# EAGLE design I2C Interface (EAGLE 9.4.2)
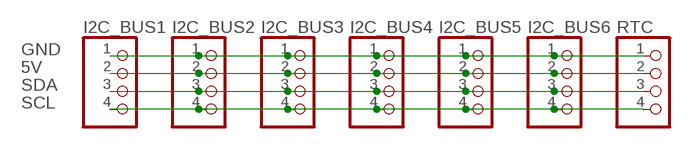
[diagram p0: schematic, sheet 1]

## Parts
I2C_BUS1  PINHD-1X4  [1X04]
I2C_BUS2  PINHD-1X4  [1X04]
I2C_BUS3  PINHD-1X4  [1X04]
I2C_BUS4  PINHD-1X4  [1X04]
I2C_BUS5  PINHD-1X4  [1X04]
I2C_BUS6  PINHD-1X4  [1X04]
RTC  PINHD-1X4  [1X04]

## Nets
5V: I2C_BUS1.2 I2C_BUS2.2 I2C_BUS3.2 I2C_BUS4.2 I2C_BUS5.2 I2C_BUS6.2 RTC.2
GND: I2C_BUS1.1 I2C_BUS2.1 I2C_BUS3.1 I2C_BUS4.1 I2C_BUS5.1 I2C_BUS6.1 RTC.1
SCL: I2C_BUS1.4 I2C_BUS2.4 I2C_BUS3.4 I2C_BUS4.4 I2C_BUS5.4 I2C_BUS6.4 RTC.4
SDA: I2C_BUS1.3 I2C_BUS2.3 I2C_BUS3.3 I2C_BUS4.3 I2C_BUS5.3 I2C_BUS6.3 RTC.3

## Library data of the parts
I2C_BUS1-I2C_BUS6 RTC = pinhead:PINHD-1X4: PIN HEADER

## Board
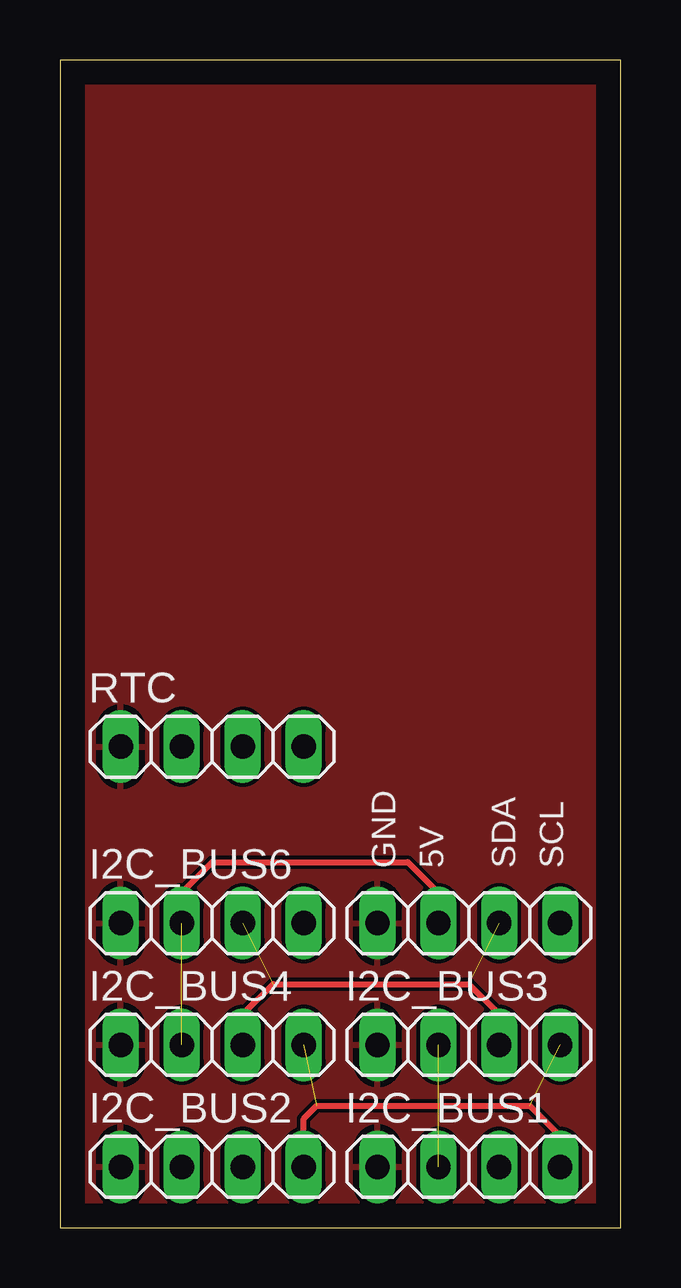
[diagram p1: board, top side]
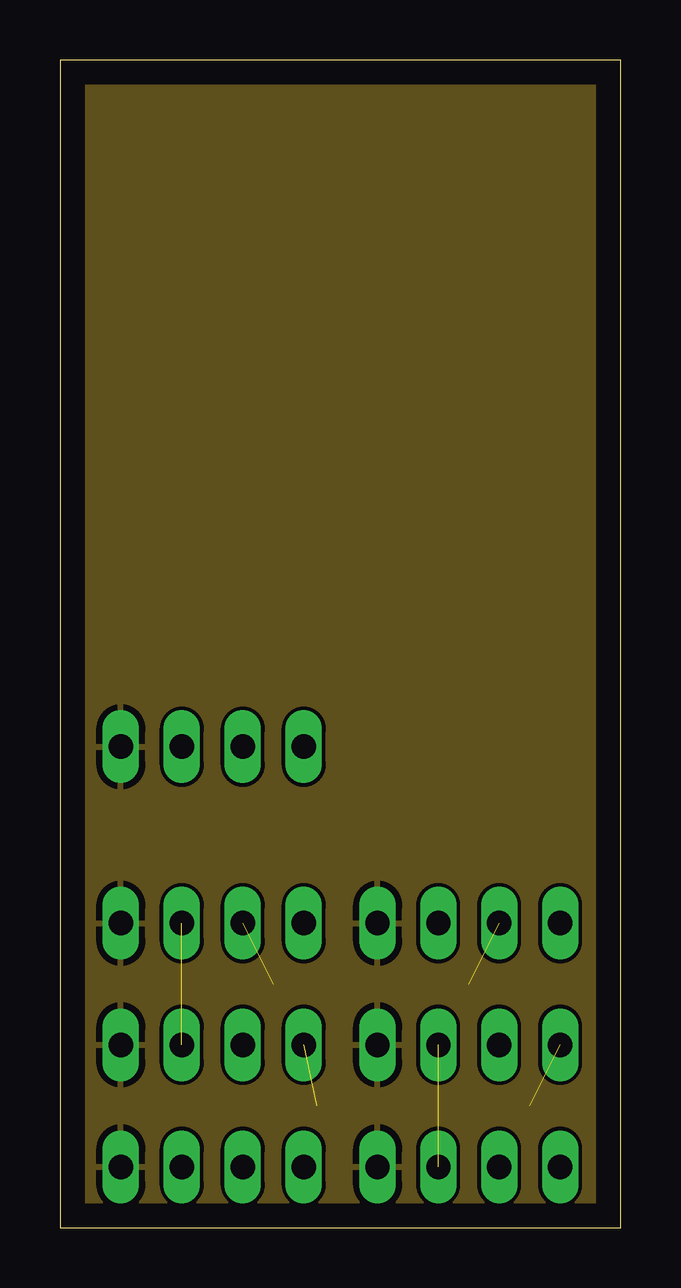
[diagram p2: board, inner layer Route2]
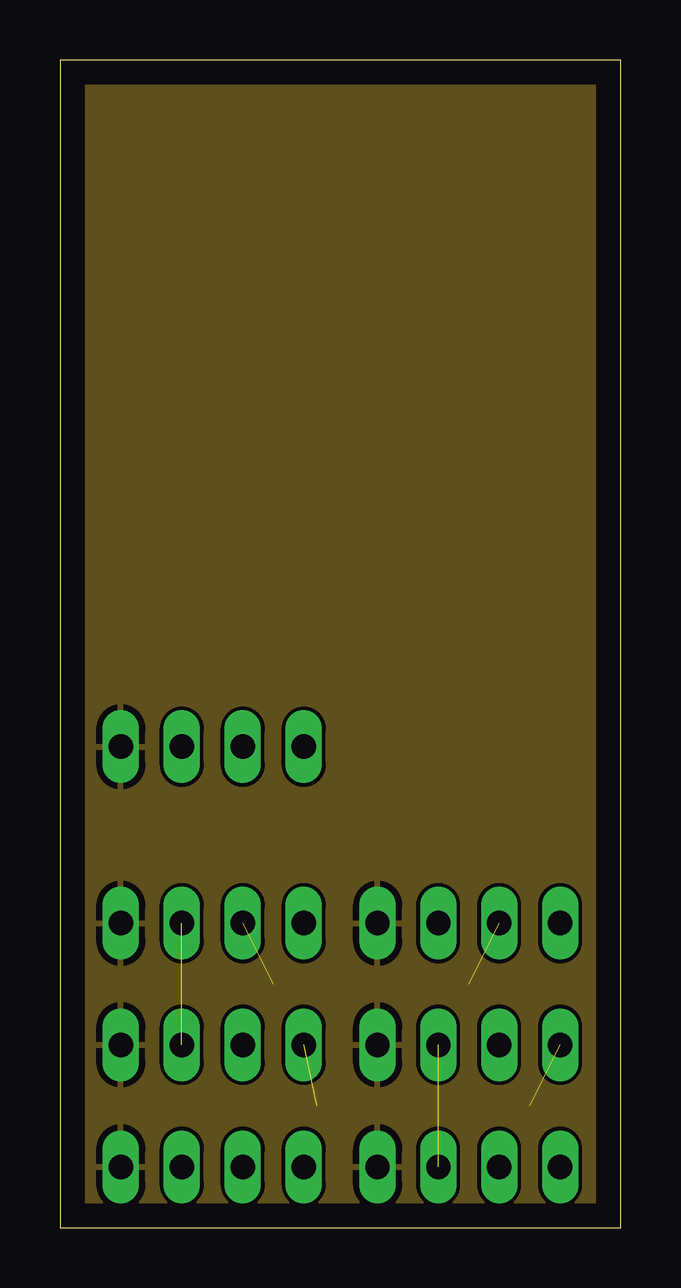
[diagram p3: board, inner layer Route15]
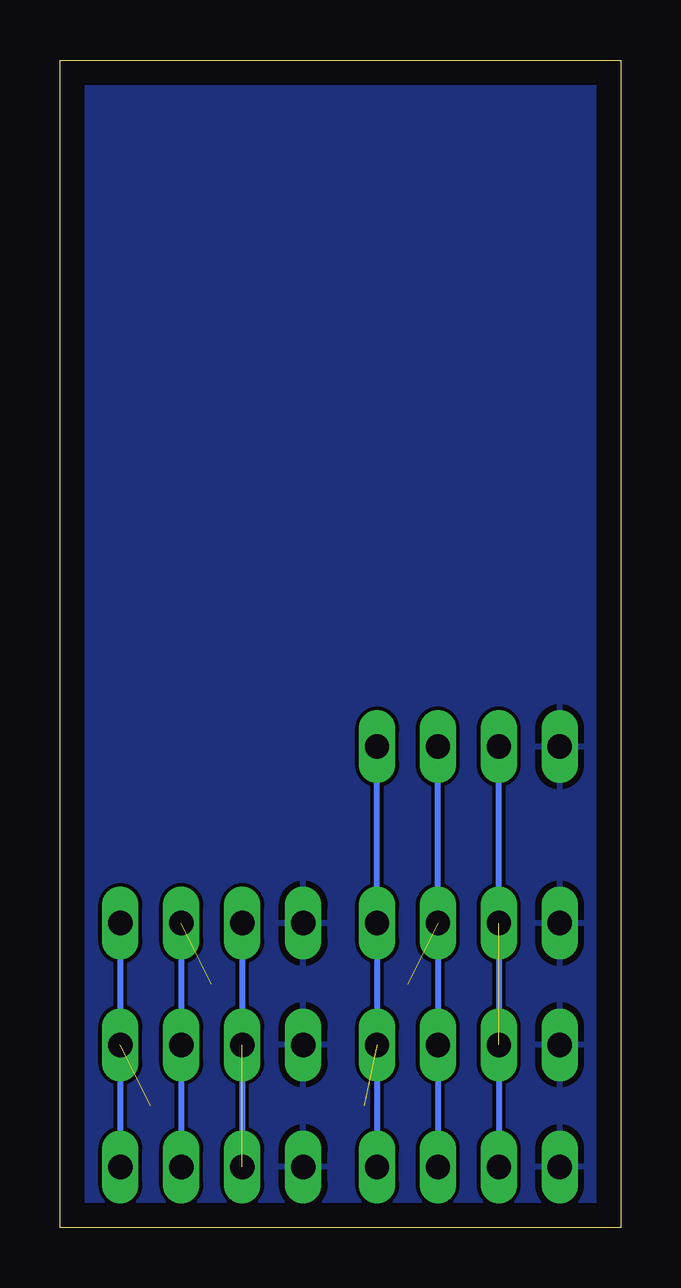
[diagram p4: board, bottom side, seen from below]

Size 23.38 x 48.66 mm. Coordinates in mm from the lower left corner, seen from the top.
Outline: 0,0 23.38,0 23.38,48.66 0,48.66 0,0
Copper layers (1+2*15+16): Top 0.035mm / dielectric 1.5mm / Route2 0.035mm / dielectric 0.15mm / Route15 0.035mm / dielectric 0.2mm / Bottom 0.035mm
Design rules "default *": minimum track width 6mil, minimum drill 0.35mm, track to track 6mil, track to pad 6mil, pad to pad 6mil, via to via 6mil, smd to smd 6mil, copper to edge 40mil, drill to drill 6mil, minimum pad ring 10mil, minimum via ring 8mil, stop-mask expansion 4mil, vias tented up to drill 0mil, thermal gap 10mil

### Footprints (pad centres in the part's own frame; a part is rotated, then mirrored left to right if it is on the bottom)
1X04 = drill 1.016 long: 1 -3.81,0; 2 -1.27,0; 3 1.27,0; 4 3.81,0

### Placement (x,y rotation side)
I2C_BUS1  17.05,2.54 0 top
I2C_BUS2  6.35,2.54 0 top
I2C_BUS3  17.05,7.62 0 top
I2C_BUS4  6.35,7.62 0 top
I2C_BUS5  17.05,12.7 0 top
I2C_BUS6  6.35,12.7 0 top
RTC  6.35,20.05 0 top

### Tracks (layer width: path | path; a pad name or v marks a point on that pad's centre or on a via)
5V  (2 unrouted)
  Top 0.254: I2C_BUS6.2 5.08,13.97 6.35,15.24 14.51,15.24 15.78,13.97 I2C_BUS5.2
  Bottom 0.254: I2C_BUS2.2 I2C_BUS6.2 RTC.2 | I2C_BUS5.2 I2C_BUS1.2
GND
  pour Top: 0,0 0,48.51 23.37,48.51 23.37,0
  pour Route15: 0,0 0,48.51 23.37,48.51 23.37,0
  pour Bottom: 0,0 0,48.51 23.37,48.51 23.37,0
  pour Route2: 0,0 0,48.51 23.37,48.51 23.37,0
SCL  (2 unrouted)
  Top 0.254: I2C_BUS2.4 10.16,4.54 10.7,5.08 19.59,5.08 20.86,3.81 I2C_BUS1.4
  Bottom 0.254: I2C_BUS2.4 I2C_BUS6.4 RTC.4 | I2C_BUS5.4 I2C_BUS1.4
SDA  (2 unrouted)
  Top 0.254: I2C_BUS4.3 7.62,8.89 8.89,10.16 17.05,10.16 18.32,8.89 I2C_BUS3.3
  Bottom 0.254: I2C_BUS2.3 I2C_BUS6.3 RTC.3 | I2C_BUS5.3 I2C_BUS1.3

### Text on the board
tNames: GND | 5V | SDA | SCL